# Altium project DMX Interface DB.PrjPcb (part 4 of 5)

## Sheet TPS922051.SchDoc: LED High Power - TPS922051
size B; SheetNumber: 13; SheetTotal: 14
Used 4 times, as channels HP_LED/HP1, HP_LED/HP2, HP_LED/HP3, HP_LED/HP4. Parts and nets are listed once, with the designators drawn on the sheet.
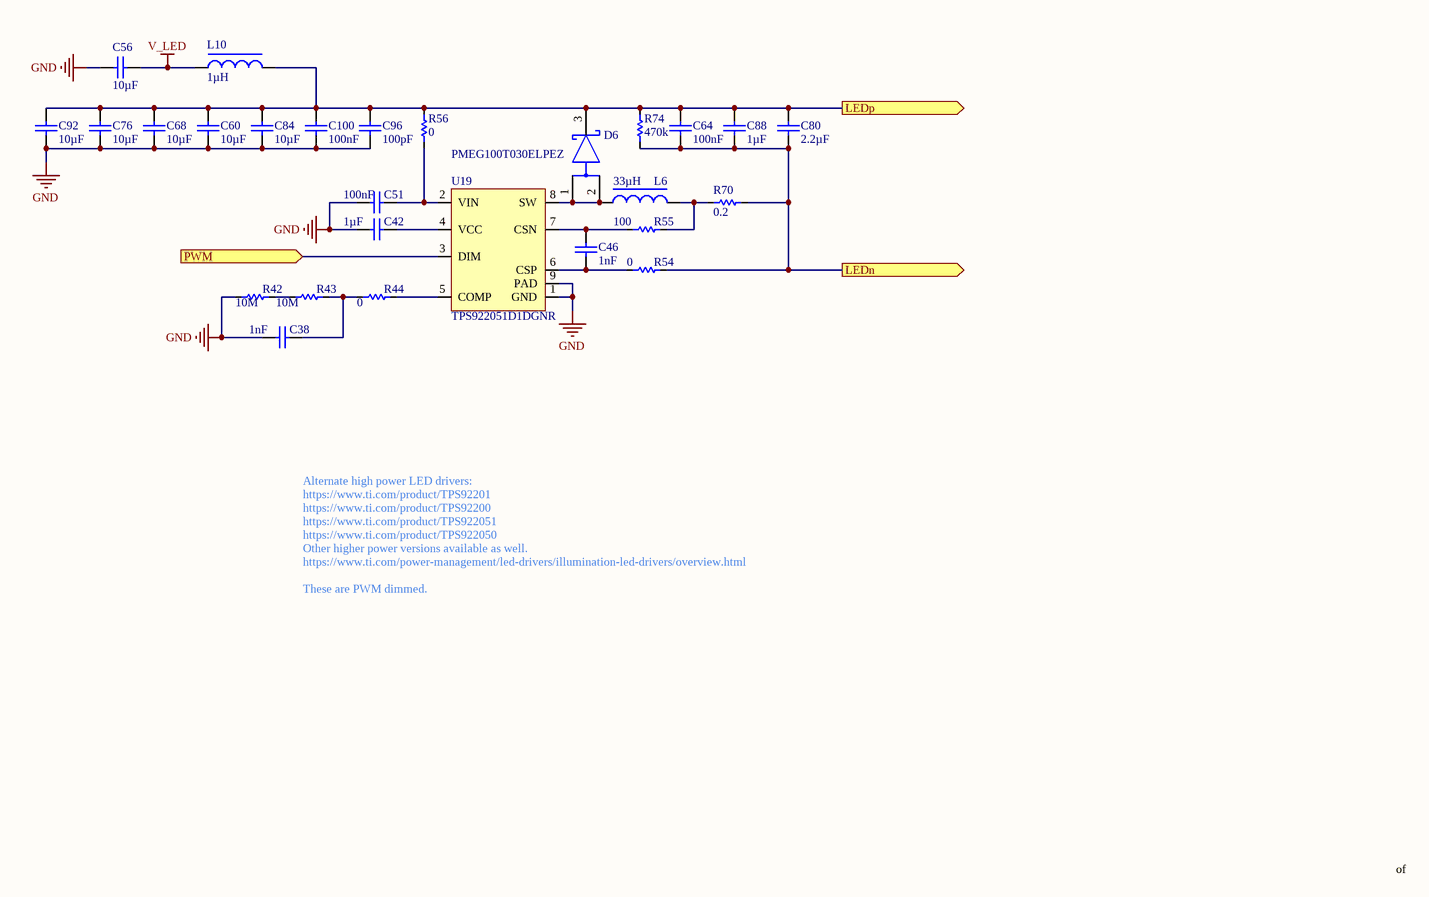
[diagram p11: TPS922051.SchDoc]

### Parts
C38  value 1nF  [CAPC1608X10N_0603_MED]  (hidden comment: C0603C102K5RACTU)
C42  value 1µF  [CAPC1608X10N_0603_MED]  (hidden comment: C1608X7R1C105K080AC)
C46  value 1nF  [CAPC1608X10N_0603_MED]  (hidden comment: C0603C102K5RACTU)
C51  value 100nF  [CAPC1608X10N_0603_MED]  (hidden comment: CC0603KRX7R0BB104)
C56  value 10µF  [CAPC2012X14N_0805_MED]  (hidden comment: GRM21BR61H106KE43L)
C60  value 10µF  [CAPC2012X14N_0805_MED]  (hidden comment: GRM21BR61H106KE43L)
C64  value 100nF  [CAPC1608X10N_0603_MED]  (hidden comment: CC0603KRX7R0BB104)
C68  value 10µF  [CAPC2012X14N_0805_MED]  (hidden comment: GRM21BR61H106KE43L)
C76  value 10µF  [CAPC2012X14N_0805_MED]  (hidden comment: GRM21BR61H106KE43L)
C80  value 2.2µF  [CAPC2012X14N_0805_MED]  (hidden comment: CGA4J3X7R1H225K125AE)
C84  value 10µF  [CAPC2012X14N_0805_MED]  (hidden comment: GRM21BR61H106KE43L)
C88  value 1µF  [CAPC2012X14N_0805_MED]  (hidden comment: CL21B105KBFNNNE)
C92  value 10µF  [CAPC2012X14N_0805_MED]  (hidden comment: GRM21BR61H106KE43L)
C96  value 100pF  [CAPC1608X10N_0603_MED]  (hidden comment: GCM1885C1H101JA16D)
C100  value 100nF  [CAPC1608X10N_0603_MED]  (hidden comment: CC0603KRX7R0BB104)
D6  PMEG100T030ELPEZ  [FP-SOT1289B-MFG]
L6  value 33µH  [SPM6545VT-330M-D-Footprint-1]  (hidden comment: SPM6545VT-330M-D)
L10  value 1µH  [WE-MAPI_3020]  (hidden comment: 74438336010)
R42  value 10M  [RESC1608X06N_0603_MED]  (hidden comment: RC0603JR-0710ML)
R43  value 10M  [RESC1608X06N_0603_MED]  (hidden comment: RC0603JR-0710ML)
R44  value 0  [RESC1608X06N_0603_MED]  (hidden comment: RC0603FR-070RL)
R54  value 0  [RESC1608X06N_0603_MED]  (hidden comment: RC0603FR-070RL)
R55  value 100  [RESC1608X06N_0603_MED]  (hidden comment: RC0603FR-07100RL)
R56  value 0  [RESC1608X06N_0603_MED]  (hidden comment: RC0603FR-070RL)
R70  value 0.2  [RESC640320X70_CRG2512_MFG]  (hidden comment: CRG2512-FZ-R200E-1)
R74  value 470k  [RESC1608X06N_0603_MED]  (hidden comment: RC0603FR-13470KL)
U19  TPS922051D1DGNR  [TPS92205x_TSOP65P490X110_HS-9N]

### Ports
LEDn (out), LEDp (out), PWM (in)

### Nets
GND: C38.1 C42.1 C51.1 C56.1 C60.1 C68.1 C76.1 C84.1 C92.1 C96.1 C100.1 R42.1 U19.1(GND) U19.9(PAD)
V_LED: C56.2 L10.1
LEDn: C64.1 C80.1 C88.1 R54.2 R70.2 R74.1 ; port LEDn
LEDp: C60.2 C64.2 C68.2 C76.2 C80.2 C84.2 C88.2 C92.2 C96.2 C100.2 D6.3(K) L10.2 R56.2 R74.2 ; port LEDp
PWM: U19.3(DIM) ; port PWM
NetC38_2: C38.2 R43.1 R44.2
NetC42_2: C42.2 U19.4(VCC)
NetC46_1: C46.1 R54.1 U19.6(CSP)
NetC46_2: C46.2 R55.1 U19.7(CSN)
NetC51_2: C51.2 R56.1 U19.2(VIN)
NetD6_1: D6.1(A) D6.2(A) L6.1 U19.8(SW)
NetL6_2: L6.2 R55.2 R70.1
NetR42_2: R42.2 R43.2
NetR44_1: R44.1 U19.5(COMP)

### Channels
HP_LED/HP1: designators end in _HP1; ports LEDn=LEDn1 LEDp=LEDp1 PWM=PWM1
HP_LED/HP2: designators end in _HP2; ports LEDn=LEDn2 LEDp=LEDp2 PWM=PWM2
HP_LED/HP3: designators end in _HP3; ports LEDn=LEDn3 LEDp=LEDp3 PWM=PWM3
HP_LED/HP4: designators end in _HP4; ports LEDn=LEDn4 LEDp=LEDp4 PWM=PWM4

### Notes on the sheet
- Alternate high power LED drivers:
  https://www.ti.com/product/TPS92201
  https://www.ti.com/product/TPS92200
  https://www.ti.com/product/TPS922051
  https://www.ti.com/product/TPS922050
  Other higher power versions available as well.
  https://www.ti.com/power-management/led-drivers/illumination-led-drivers/overview.html
  These are PWM dimmed.
- of

### Library data of the parts
C38 C46 = CMP-001-00160-2: Ceramic Capacitor, Multilayer, Ceramic, 50V, 10% +Tol, 10% -Tol, X7R, 15% TC, 0.001uF, Surface Mount, 0603; RoHS Compliant: Yes; Mounting Technology: Surface Mount; Case/Package: 0603; Pins: 2; Min Operating Temperature: -55°C; Tolerance: 10%; Voltage Rating: 50V; Capacitor Type: Ceramic; Max Operating Temperature: 125°C; JLCPN: C2167129
C42 = CMP-001-00121-2: as C17 on sheet SmartLED; Capacitor Type: Ceramic; RoHS Compliant: Yes; Min Operating Temperature: -55°C; Pins: 2; Tolerance: 10%; Max Operating Temperature: 125°C; Mounting Technology: Surface Mount; Voltage Rating: 16V; Case/Package: 0603; JLCPN: C59782
C51 C64 C100 = CMP-001-00102-4: as C34 on sheet LED_low_side_control; RoHS Compliant: Yes; Voltage Rating: 100V; Capacitor Type: Ceramic; Case/Package: 0603; Pins: 2; Min Operating Temperature: -55°C; Mounting Technology: Surface Mount; Max Operating Temperature: 125°C; JLCPN: C113803
C56 C60 C68 C76 C84 C92 = CMP-001-00169-2: as C24 on sheet Microcontroller; Mounting Technology: Surface Mount; Case/Package: 0805; Tolerance: 10%; RoHS Compliant: Yes; Capacitor Type: Ceramic; Max Operating Temperature: 85°C; Min Operating Temperature: -55°C; Pins: 2; Voltage Rating: 50V; JLCPN: C440198
C80 = CMP-001-00170-2: Ceramic Capacitor, Multilayer, Ceramic, 2.2uF, 50V, 10%, X6S, 0805; Max Operating Temperature: 125°C; Min Operating Temperature: -55°C; Voltage Rating: 50V; Tolerance: 10%; Capacitor Type: Ceramic; RoHS Compliant: Yes; Pins: 2; Mounting Technology: Surface Mount; Case/Package: 0805; JLCPN: C125847
C88 = CMP-001-00171-2: as C18 on sheet SmartLED; Max Operating Temperature: 125°C; RoHS Compliant: Yes; Mounting Technology: Surface Mount; Case/Package: 0805; Tolerance: 10%; Pins: 2; Voltage Rating: 50V; Min Operating Temperature: -55°C; Capacitor Type: Ceramic; JLCPN: C28323
C96 = CMP-001-00168-2: Ceramic Capacitor, Multilayer, Ceramic, 50V, 5% Tol X7R, 100pF, Surface Mount, 0603; Max Operating Temperature: 125°C; Capacitor Type: Ceramic; RoHS Compliant: Yes; Min Operating Temperature: -55°C; Voltage Rating: 50V; Case/Package: 0603; Mounting Technology: Surface Mount; Pins: 2; Tolerance: 5%; JLCPN: C126543
D6 = CMP-004-00051-2: Schottky Rectifier, Single, 100V, 3A Rohs Compliant: Yes; Forward Current: 3A; Max Operating Temperature: 175°C; JLCPN: C3759829
L6 = CMP-006-00033-2: General Purpose Inductor, 33uH, 20%, 1 Element, Metal Composite-Core, SMD, 2826; Current Rating: 4.4A; Max Current Rating: 2.7A; Min Operating Temperature: -55°C; Tolerance: 20%; Max Operating Temperature: 155°C; Case/Package: 2826; JLCPN: C2847546
L10 = CMP-006-00032-2: Inductors, Fixed, WE-MAPI SMD 3020 1.0uH 4.0A 32mOhm; Current Rating: 4A; Tolerance: 20%; Self Resonant Frequency: 67MHz; Case/Package: SMD/SMT; Max Operating Temperature: 125°C; Pins: 2; Min Operating Temperature: -40°C; Mounting Technology: Surface Mount; JLCPN: C7423316
R42 R43 = CMP-009-00338-2: Fixed Resistor, Metal Glaze/thick Film, 0.1W, 10Mohm, 75V, 1% +/-Tol, 100ppm/Cel, Surface Mount, 0603; Power: 100mW; Tolerance: 5%; Voltage Rating: 50V; Min Operating Temperature: -55°C; Max Operating Temperature: 155°C; Pins: 2; Case/Package: 0603; RoHS Compliant: Yes; Mounting Technology: Surface Mount; JLCPN: C141675
R44 R54 R56 = CMP-009-00204-3: as R31 on sheet LED_low_side_control; Mounting Technology: Surface Mount; Pins: 2; Case/Package: 0603; Max Operating Temperature: 155°C; Min Operating Temperature: -55°C; RoHS Compliant: Yes; JLCPN: C100044
R55 = CMP-009-00319-2: Fixed Resistor, Metal Glaze/thick Film, 0.1W, 100ohm, 75V, 1% +/-Tol, 100ppm/Cel, Surface Mount, 0603; Power: 100mW; Voltage Rating: 50V; Tolerance: 1%; Mounting Technology: Surface Mount; RoHS Compliant: Yes; Case/Package: 0603; Max Operating Temperature: 155°C; Pins: 2; Min Operating Temperature: -55°C; JLCPN: C105588
R70 = CMP-009-00340-2: Res Metal Strip 2512 0.2 Ohm 1% 1W ±50ppm/°C Sulfur Resistant Pad SMD T/R Automotive AEC-Q200; Max Operating Temperature: 170°C; Min Operating Temperature: -55°C; Case/Package: 2512; Mounting Technology: Surface Mount; Tolerance: 1%; JLCPN: C309535
R74 = CMP-009-00339-2: Fixed Resistor, Metal Glaze/thick Film, 0.1W, 470Kohm, 75V, 1% +/-Tol, 100ppm/Cel, Surface Mount, 0603; Power: 100mW; Voltage Rating: 50V; Min Operating Temperature: -55°C; Tolerance: 1%; Mounting Technology: Surface Mount; Max Operating Temperature: 155°C; Pins: 2; RoHS Compliant: Yes; Case/Package: 0603; JLCPN: C114622
U19 = CMP-00024-00009-2: 65V, 2A buck LED driver with analog or PWM dimming options 8-HVSSOP -40 to 85; Pins: 8; Mounting Technology: SMT; JLCPN: C48922727

## Sheet Module Connector Female.SchDoc: Module Connector Female
size B; SheetNumber: 11; SheetTotal: 14
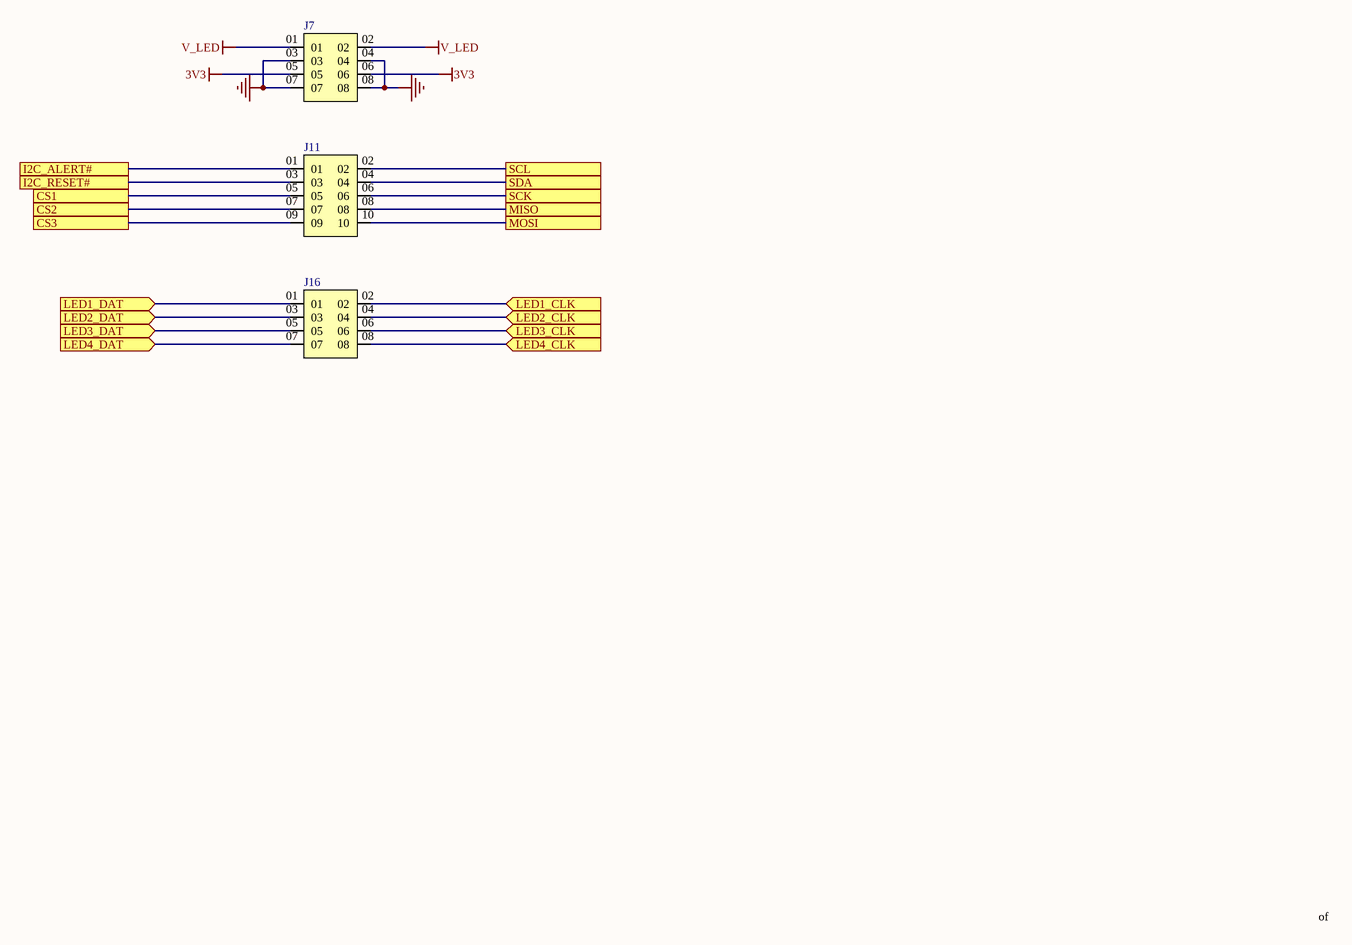
[diagram p12: Module Connector Female.SchDoc]

### Parts
J7  Socket 4x2 0.1" RA  [Socket 4x2 0.1" RA]  (value not drawn)
J11  Socket 5x2 0.1" RA  [Socket 5x2 0.1" RA Through Hole]  (value not drawn)
J16  Socket 4x2 0.1" RA  [Socket 4x2 0.1" RA]  (value not drawn)

### Ports
CS1, CS2, CS3, I2C_ALERT#, I2C_RESET#, LED1_CLK (in), LED1_DAT (in), LED2_CLK (in), LED2_DAT (in), LED3_CLK (in), LED3_DAT (in), LED4_CLK (in), LED4_DAT (in), MISO, MOSI, SCK, SCL, SDA

### Nets
3V3: J7.05 J7.06
GND: J7.03 J7.04 J7.07 J7.08
V_LED: J7.01 J7.02
CS1: J11.05 ; port CS1
CS2: J11.07 ; port CS2
CS3: J11.09 ; port CS3
I2C_ALERT#: J11.01 ; port I2C_ALERT#
I2C_RESET#: J11.03 ; port I2C_RESET#
LED1_CLK: J16.02 ; port LED1_CLK
LED1_DAT: J16.01 ; port LED1_DAT
LED2_CLK: J16.04 ; port LED2_CLK
LED2_DAT: J16.03 ; port LED2_DAT
LED3_CLK: J16.06 ; port LED3_CLK
LED3_DAT: J16.05 ; port LED3_DAT
LED4_CLK: J16.08 ; port LED4_CLK
LED4_DAT: J16.07 ; port LED4_DAT
MISO: J11.08 ; port MISO
MOSI: J11.10 ; port MOSI
SCK: J11.06 ; port SCK
SCL: J11.02 ; port SCL
SDA: J11.04 ; port SDA

### Notes on the sheet
- of

### Library data of the parts
J7 J16 = CMP-002-00225-3: Board Connector, 8 Contact(s), 2 Row(s), Female, Right Angle, 0.1 inch Pitch, Solder Terminal, Black Insulator, Socket; Max Current Rating: 3A; Min Operating Temperature: -65°C; Connector Type: BOARD CONNECTOR; RoHS Compliant: Yes; Pins: 8; Mounting Technology: Board; Max Operating Temperature: 105°C; Gender: Female
J11 = CMP-002-00229-3: Board Connector, 10 Contact(s), 2 Row(s), Female, Right Angle, 0.1 inch Pitch, Solder Terminal, Black Insulator, Socket; Max Current Rating: 3A; Gender: Female; Connector Type: BOARD CONNECTOR; Min Operating Temperature: -65°C; Pins: 10; Max Operating Temperature: 105°C; RoHS Compliant: Yes; Mounting Technology: Through Hole

## Sheet Drive Select.SchDoc
size B; SheetNumber: 14; SheetTotal: 14
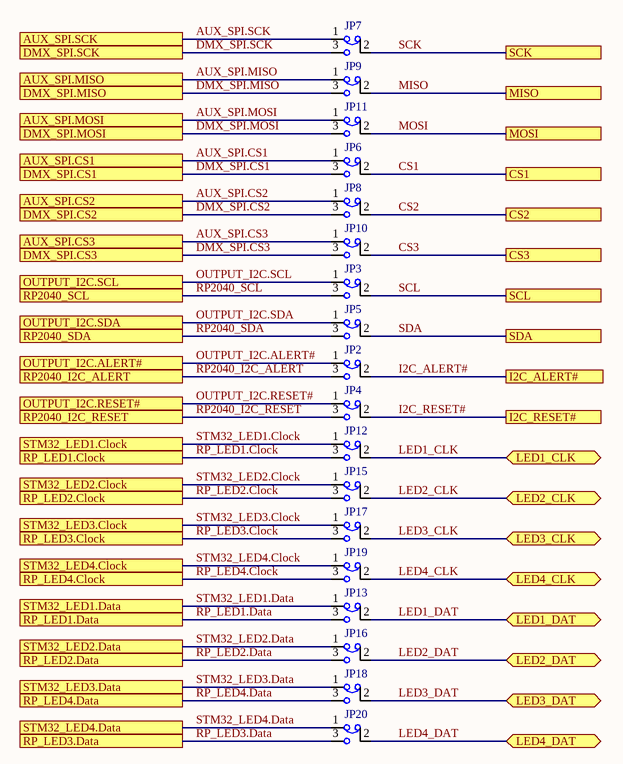
[diagram p13: Drive Select.SchDoc]

### Parts
JP2  Jumper 3 x 1 Bridge 1-2 Solder Bridge  [Jumper 3 Solder Bridge 1-2 0603]  (value not drawn)
JP3  Jumper 3 x 1 Bridge 1-2 Solder Bridge  [Jumper 3 Solder Bridge 1-2 0603]  (value not drawn)
JP4  Jumper 3 x 1 Bridge 1-2 Solder Bridge  [Jumper 3 Solder Bridge 1-2 0603]  (value not drawn)
JP5  Jumper 3 x 1 Bridge 1-2 Solder Bridge  [Jumper 3 Solder Bridge 1-2 0603]  (value not drawn)
JP6  Jumper 3 x 1 Bridge 1-2 Solder Bridge  [Jumper 3 Solder Bridge 1-2 0603]  (value not drawn)
JP7  Jumper 3 x 1 Bridge 1-2 Solder Bridge  [Jumper 3 Solder Bridge 1-2 0603]  (value not drawn)
JP8  Jumper 3 x 1 Bridge 1-2 Solder Bridge  [Jumper 3 Solder Bridge 1-2 0603]  (value not drawn)
JP9  Jumper 3 x 1 Bridge 1-2 Solder Bridge  [Jumper 3 Solder Bridge 1-2 0603]  (value not drawn)
JP10  Jumper 3 x 1 Bridge 1-2 Solder Bridge  [Jumper 3 Solder Bridge 1-2 0603]  (value not drawn)
JP11  Jumper 3 x 1 Bridge 1-2 Solder Bridge  [Jumper 3 Solder Bridge 1-2 0603]  (value not drawn)
JP12  Jumper 3 x 1 Bridge 1-2 Solder Bridge  [Jumper 3 Solder Bridge 1-2 0603]  (value not drawn)
JP13  Jumper 3 x 1 Bridge 1-2 Solder Bridge  [Jumper 3 Solder Bridge 1-2 0603]  (value not drawn)
JP15  Jumper 3 x 1 Bridge 1-2 Solder Bridge  [Jumper 3 Solder Bridge 1-2 0603]  (value not drawn)
JP16  Jumper 3 x 1 Bridge 1-2 Solder Bridge  [Jumper 3 Solder Bridge 1-2 0603]  (value not drawn)
JP17  Jumper 3 x 1 Bridge 1-2 Solder Bridge  [Jumper 3 Solder Bridge 1-2 0603]  (value not drawn)
JP18  Jumper 3 x 1 Bridge 1-2 Solder Bridge  [Jumper 3 Solder Bridge 1-2 0603]  (value not drawn)
JP19  Jumper 3 x 1 Bridge 1-2 Solder Bridge  [Jumper 3 Solder Bridge 1-2 0603]  (value not drawn)
JP20  Jumper 3 x 1 Bridge 1-2 Solder Bridge  [Jumper 3 Solder Bridge 1-2 0603]  (value not drawn)

### Ports
AUX_SPI.CS1, AUX_SPI.CS2, AUX_SPI.CS3, AUX_SPI.MISO, AUX_SPI.MOSI, AUX_SPI.SCK, CS1, CS2, CS3, DMX_SPI.CS1, DMX_SPI.CS2, DMX_SPI.CS3, DMX_SPI.MISO, DMX_SPI.MOSI, DMX_SPI.SCK, I2C_ALERT#, I2C_RESET#, LED1_CLK (bidir), LED1_DAT (bidir), LED2_CLK (bidir), LED2_DAT (bidir), LED3_CLK (bidir), LED3_DAT (bidir), LED4_CLK (bidir), LED4_DAT (bidir), MISO, MOSI, OUTPUT_I2C.ALERT#, OUTPUT_I2C.RESET#, OUTPUT_I2C.SCL, OUTPUT_I2C.SDA, RP2040_I2C_ALERT, RP2040_I2C_RESET, RP2040_SCL, RP2040_SDA, RP_LED1.Clock, RP_LED1.Data, RP_LED2.Clock, RP_LED2.Data, RP_LED3.Clock, RP_LED3.Data, RP_LED4.Clock, RP_LED4.Data, SCK, SCL, SDA, STM32_LED1.Clock, STM32_LED1.Data, STM32_LED2.Clock, STM32_LED2.Data, STM32_LED3.Clock, STM32_LED3.Data, STM32_LED4.Clock, STM32_LED4.Data

### Nets
AUX_SPI.CS1: JP6.1 ; port AUX_SPI.CS1
AUX_SPI.CS2: JP8.1 ; port AUX_SPI.CS2
AUX_SPI.CS3: JP10.1 ; port AUX_SPI.CS3
AUX_SPI.MISO: JP9.1 ; port AUX_SPI.MISO
AUX_SPI.MOSI: JP11.1 ; port AUX_SPI.MOSI
AUX_SPI.SCK: JP7.1 ; port AUX_SPI.SCK
CS1: JP6.2 ; port CS1
CS2: JP8.2 ; port CS2
CS3: JP10.2 ; port CS3
DMX_SPI.CS1: JP6.3 ; port DMX_SPI.CS1
DMX_SPI.CS2: JP8.3 ; port DMX_SPI.CS2
DMX_SPI.CS3: JP10.3 ; port DMX_SPI.CS3
DMX_SPI.MISO: JP9.3 ; port DMX_SPI.MISO
DMX_SPI.MOSI: JP11.3 ; port DMX_SPI.MOSI
DMX_SPI.SCK: JP7.3 ; port DMX_SPI.SCK
I2C_ALERT#: JP2.2 ; port I2C_ALERT#
I2C_RESET#: JP4.2 ; port I2C_RESET#
LED1_CLK: JP12.2 ; port LED1_CLK
LED1_DAT: JP13.2 ; port LED1_DAT
LED2_CLK: JP15.2 ; port LED2_CLK
LED2_DAT: JP16.2 ; port LED2_DAT
LED3_CLK: JP17.2 ; port LED3_CLK
LED3_DAT: JP18.2 ; port LED3_DAT
LED4_CLK: JP19.2 ; port LED4_CLK
LED4_DAT: JP20.2 ; port LED4_DAT
MISO: JP9.2 ; port MISO
MOSI: JP11.2 ; port MOSI
OUTPUT_I2C.ALERT#: JP2.1 ; port OUTPUT_I2C.ALERT#
OUTPUT_I2C.RESET#: JP4.1 ; port OUTPUT_I2C.RESET#
OUTPUT_I2C.SCL: JP3.1 ; port OUTPUT_I2C.SCL
OUTPUT_I2C.SDA: JP5.1 ; port OUTPUT_I2C.SDA
RP2040_I2C_ALERT: JP2.3 ; port RP2040_I2C_ALERT
RP2040_I2C_RESET: JP4.3 ; port RP2040_I2C_RESET
RP2040_SCL: JP3.3 ; port RP2040_SCL
RP2040_SDA: JP5.3 ; port RP2040_SDA
RP_LED1.Clock: JP12.3 ; port RP_LED1.Clock
RP_LED1.Data: JP13.3 ; port RP_LED1.Data
RP_LED2.Clock: JP15.3 ; port RP_LED2.Clock
RP_LED2.Data: JP16.3 ; port RP_LED2.Data
RP_LED3.Clock: JP17.3 ; port RP_LED3.Clock
RP_LED3.Data: JP20.3 ; port RP_LED3.Data
RP_LED4.Clock: JP19.3 ; port RP_LED4.Clock
RP_LED4.Data: JP18.3 ; port RP_LED4.Data
SCK: JP7.2 ; port SCK
SCL: JP3.2 ; port SCL
SDA: JP5.2 ; port SDA
STM32_LED1.Clock: JP12.1 ; port STM32_LED1.Clock
STM32_LED1.Data: JP13.1 ; port STM32_LED1.Data
STM32_LED2.Clock: JP15.1 ; port STM32_LED2.Clock
STM32_LED2.Data: JP16.1 ; port STM32_LED2.Data
STM32_LED3.Clock: JP17.1 ; port STM32_LED3.Clock
STM32_LED3.Data: JP18.1 ; port STM32_LED3.Data
STM32_LED4.Clock: JP19.1 ; port STM32_LED4.Clock
STM32_LED4.Data: JP20.1 ; port STM32_LED4.Data

### Library data of the parts
JP2-JP13 JP15-JP20 = CMP-009-00341-2: as JP29 on sheet STM32; RoHS Compliant: Yes; Mounting Technology: Surface Mount; Max Operating Temperature: 155°C; Min Operating Temperature: -55°C; Pins: 2; Case/Package: 0603